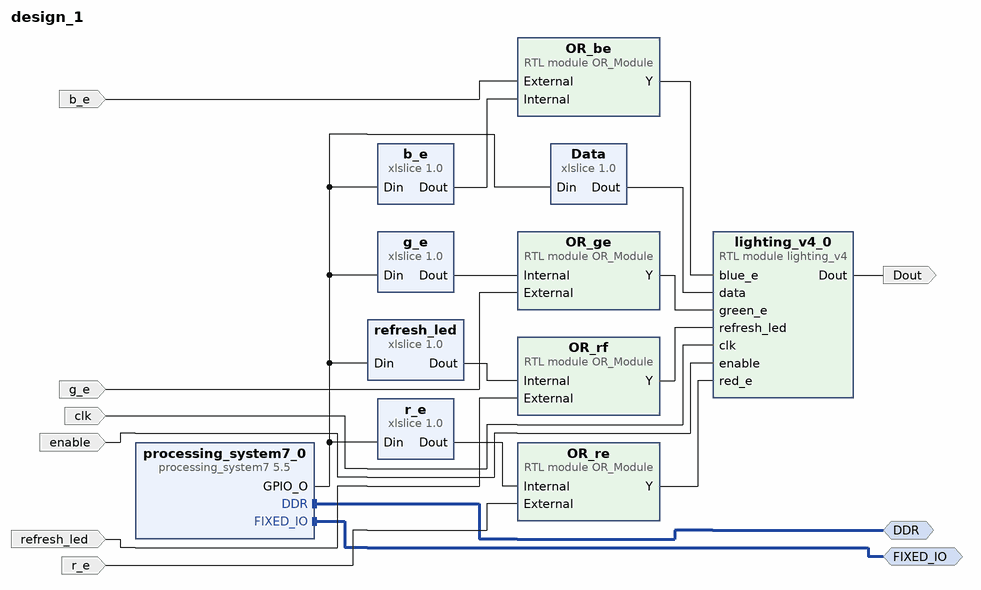
[diagram p0: block diagram of the top level]
# Vivado block design design_1, xc7z020clg400-1, Vivado 2022.1
create_bd_design design_1

create_bd_intf_port -mode Master -vlnv xilinx.com:interface:ddrx_rtl:1.0 DDR
create_bd_intf_port -mode Master -vlnv xilinx.com:display_processing_system7:fixedio_rtl:1.0 FIXED_IO
create_bd_port -dir O Dout
create_bd_port -dir I r_e
create_bd_port -dir I b_e
create_bd_port -dir I g_e
create_bd_port -dir I refresh_led
create_bd_port -dir I -type clk clk
set_property -dict {CONFIG.FREQ_HZ 125000000} [get_bd_ports clk]
create_bd_port -dir I enable

create_bd_cell -type ip -vlnv xilinx.com:ip:processing_system7:5.5 processing_system7_0
set_property -dict [list \
  CONFIG.PCW_APU_PERIPHERAL_FREQMHZ 650 \
  CONFIG.PCW_CRYSTAL_PERIPHERAL_FREQMHZ 50 \
  CONFIG.PCW_ENET0_PERIPHERAL_ENABLE 0 \
  CONFIG.PCW_EN_CLK0_PORT 0 \
  CONFIG.PCW_FPGA0_PERIPHERAL_FREQMHZ 100 \
  CONFIG.PCW_FPGA1_PERIPHERAL_FREQMHZ 50 \
  CONFIG.PCW_GPIO_EMIO_GPIO_ENABLE 1 \
  CONFIG.PCW_GPIO_EMIO_GPIO_IO 12 \
  CONFIG.PCW_GPIO_EMIO_GPIO_WIDTH 12 \
  CONFIG.PCW_GPIO_MIO_GPIO_ENABLE 0 \
  CONFIG.PCW_PERIPHERAL_BOARD_PRESET None \
  CONFIG.PCW_PRESET_BANK1_VOLTAGE {LVCMOS 1.8V} \
  CONFIG.PCW_QSPI_PERIPHERAL_ENABLE 0 \
  CONFIG.PCW_SD0_PERIPHERAL_ENABLE 0 \
  CONFIG.PCW_SDIO_PERIPHERAL_FREQMHZ 50 \
  CONFIG.PCW_UART1_PERIPHERAL_ENABLE 0 \
  CONFIG.PCW_UART_PERIPHERAL_FREQMHZ 100 \
  CONFIG.PCW_UIPARAM_DDR_BUS_WIDTH {16 Bit} \
  CONFIG.PCW_UIPARAM_DDR_FREQ_MHZ 525 \
  CONFIG.PCW_UIPARAM_DDR_PARTNO {MT41J256M16 RE-125} \
  CONFIG.PCW_USB0_PERIPHERAL_ENABLE 0 \
  CONFIG.PCW_USE_M_AXI_GP0 0 \
] [get_bd_cells processing_system7_0]
# 417 more settings of processing_system7_0 are not shown: defaults, MIO pin electricals, DDR timing, and values the tool derives
create_bd_cell -type module -reference lighting_v4 lighting_v4_0
create_bd_cell -type ip -vlnv xilinx.com:ip:xlslice:1.0 Data
set_property -dict {CONFIG.DIN_FROM 7 CONFIG.DIN_WIDTH 12 CONFIG.DOUT_WIDTH 8} [get_bd_cells Data]
create_bd_cell -type ip -vlnv xilinx.com:ip:xlslice:1.0 g_e
set_property -dict {CONFIG.DIN_FROM 10 CONFIG.DIN_TO 10 CONFIG.DIN_WIDTH 12} [get_bd_cells g_e]
create_bd_cell -type ip -vlnv xilinx.com:ip:xlslice:1.0 b_e
set_property -dict {CONFIG.DIN_FROM 9 CONFIG.DIN_TO 9 CONFIG.DIN_WIDTH 12} [get_bd_cells b_e]
create_bd_cell -type ip -vlnv xilinx.com:ip:xlslice:1.0 r_e
set_property -dict {CONFIG.DIN_FROM 8 CONFIG.DIN_TO 8 CONFIG.DIN_WIDTH 12 CONFIG.DOUT_WIDTH 1} [get_bd_cells r_e]
create_bd_cell -type ip -vlnv xilinx.com:ip:xlslice:1.0 refresh_led
set_property -dict {CONFIG.DIN_FROM 11 CONFIG.DIN_TO 11 CONFIG.DIN_WIDTH 12} [get_bd_cells refresh_led]
create_bd_cell -type module -reference OR_Module OR_re
create_bd_cell -type module -reference OR_Module OR_ge
create_bd_cell -type module -reference OR_Module OR_be
create_bd_cell -type module -reference OR_Module OR_rf

# ---- connections ----

connect_bd_intf_net [get_bd_intf_ports DDR] [get_bd_intf_pins processing_system7_0/DDR]
connect_bd_intf_net [get_bd_intf_ports FIXED_IO] [get_bd_intf_pins processing_system7_0/FIXED_IO]
connect_bd_net [get_bd_pins Data/Dout] [get_bd_pins lighting_v4_0/data]
connect_bd_net [get_bd_pins OR_be/Y] [get_bd_pins lighting_v4_0/blue_e]
connect_bd_net [get_bd_pins OR_ge/Y] [get_bd_pins lighting_v4_0/green_e]
connect_bd_net [get_bd_pins OR_re/Y] [get_bd_pins lighting_v4_0/red_e]
connect_bd_net [get_bd_pins OR_rf/Y] [get_bd_pins lighting_v4_0/refresh_led]
connect_bd_net [get_bd_ports b_e] [get_bd_pins OR_be/External]
connect_bd_net [get_bd_pins b_e/Dout] [get_bd_pins OR_be/Internal]
connect_bd_net [get_bd_ports clk] [get_bd_pins lighting_v4_0/clk]
connect_bd_net [get_bd_ports enable] [get_bd_pins lighting_v4_0/enable]
connect_bd_net [get_bd_ports g_e] [get_bd_pins OR_ge/External]
connect_bd_net [get_bd_pins g_e/Dout] [get_bd_pins OR_ge/Internal]
connect_bd_net [get_bd_pins lighting_v4_0/Dout] [get_bd_ports Dout]
connect_bd_net [get_bd_pins processing_system7_0/GPIO_O] \
  [get_bd_pins Data/Din] [get_bd_pins r_e/Din] [get_bd_pins b_e/Din] [get_bd_pins g_e/Din] [get_bd_pins refresh_led/Din]
connect_bd_net [get_bd_ports r_e] [get_bd_pins OR_re/External]
connect_bd_net [get_bd_pins r_e/Dout] [get_bd_pins OR_re/Internal]
connect_bd_net [get_bd_ports refresh_led] [get_bd_pins OR_rf/External]
connect_bd_net [get_bd_pins refresh_led/Dout] [get_bd_pins OR_rf/Internal]

validate_bd_design
save_bd_design
